# EAGLE design mutteruhr-Haus (EAGLE 6.4)
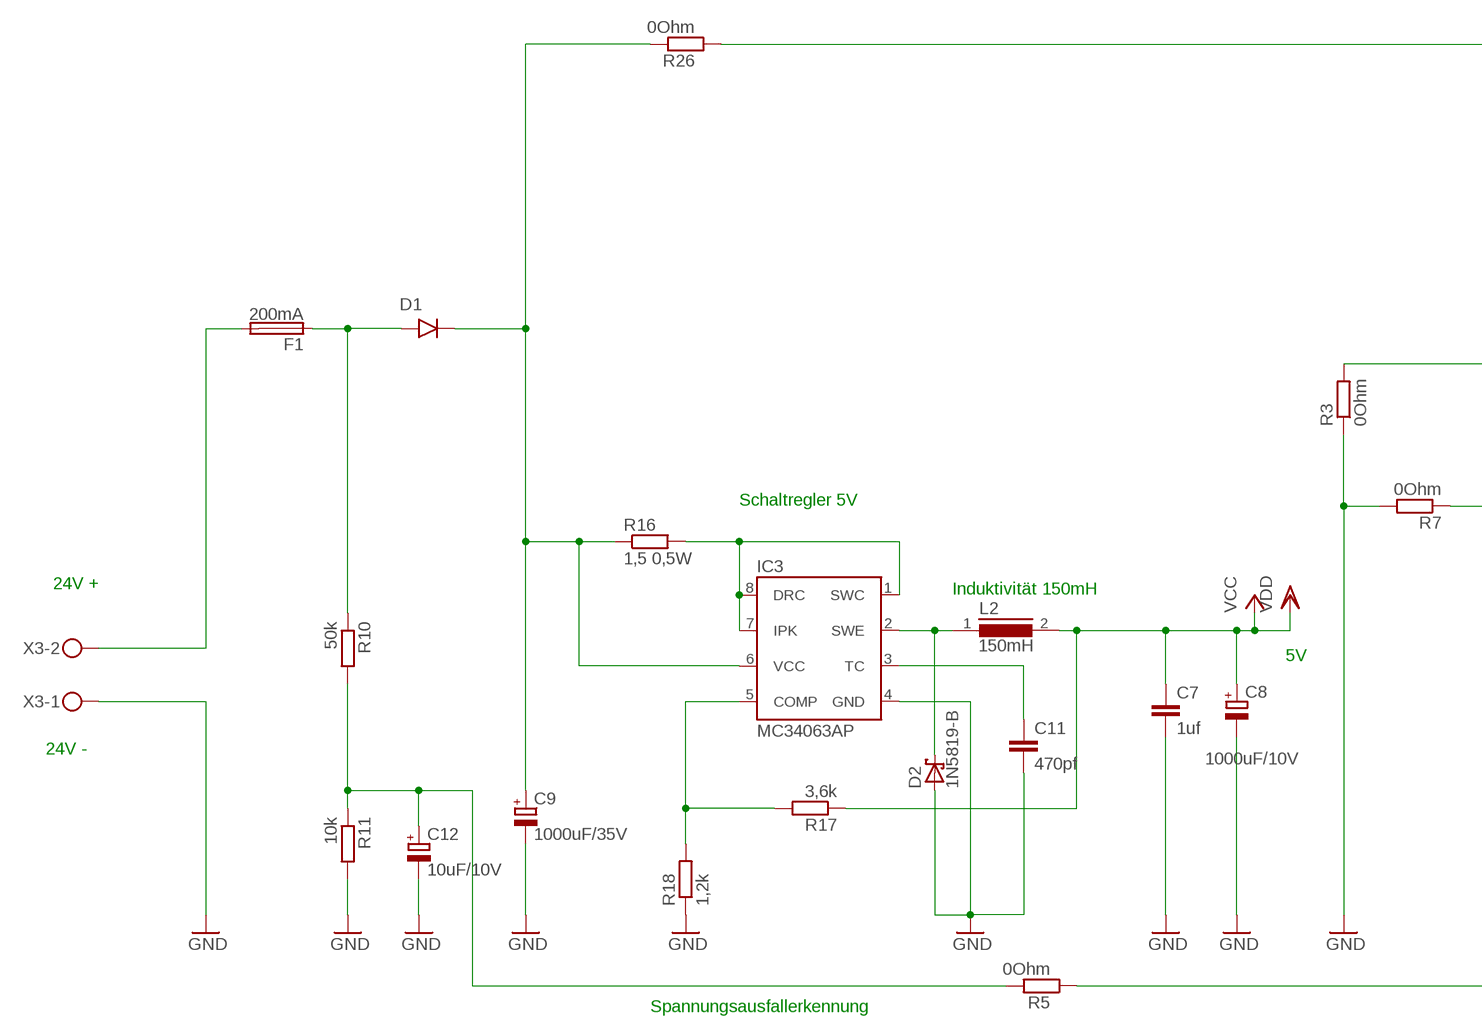
[diagram p0: schematic, sheet 1, part 1 of 2]
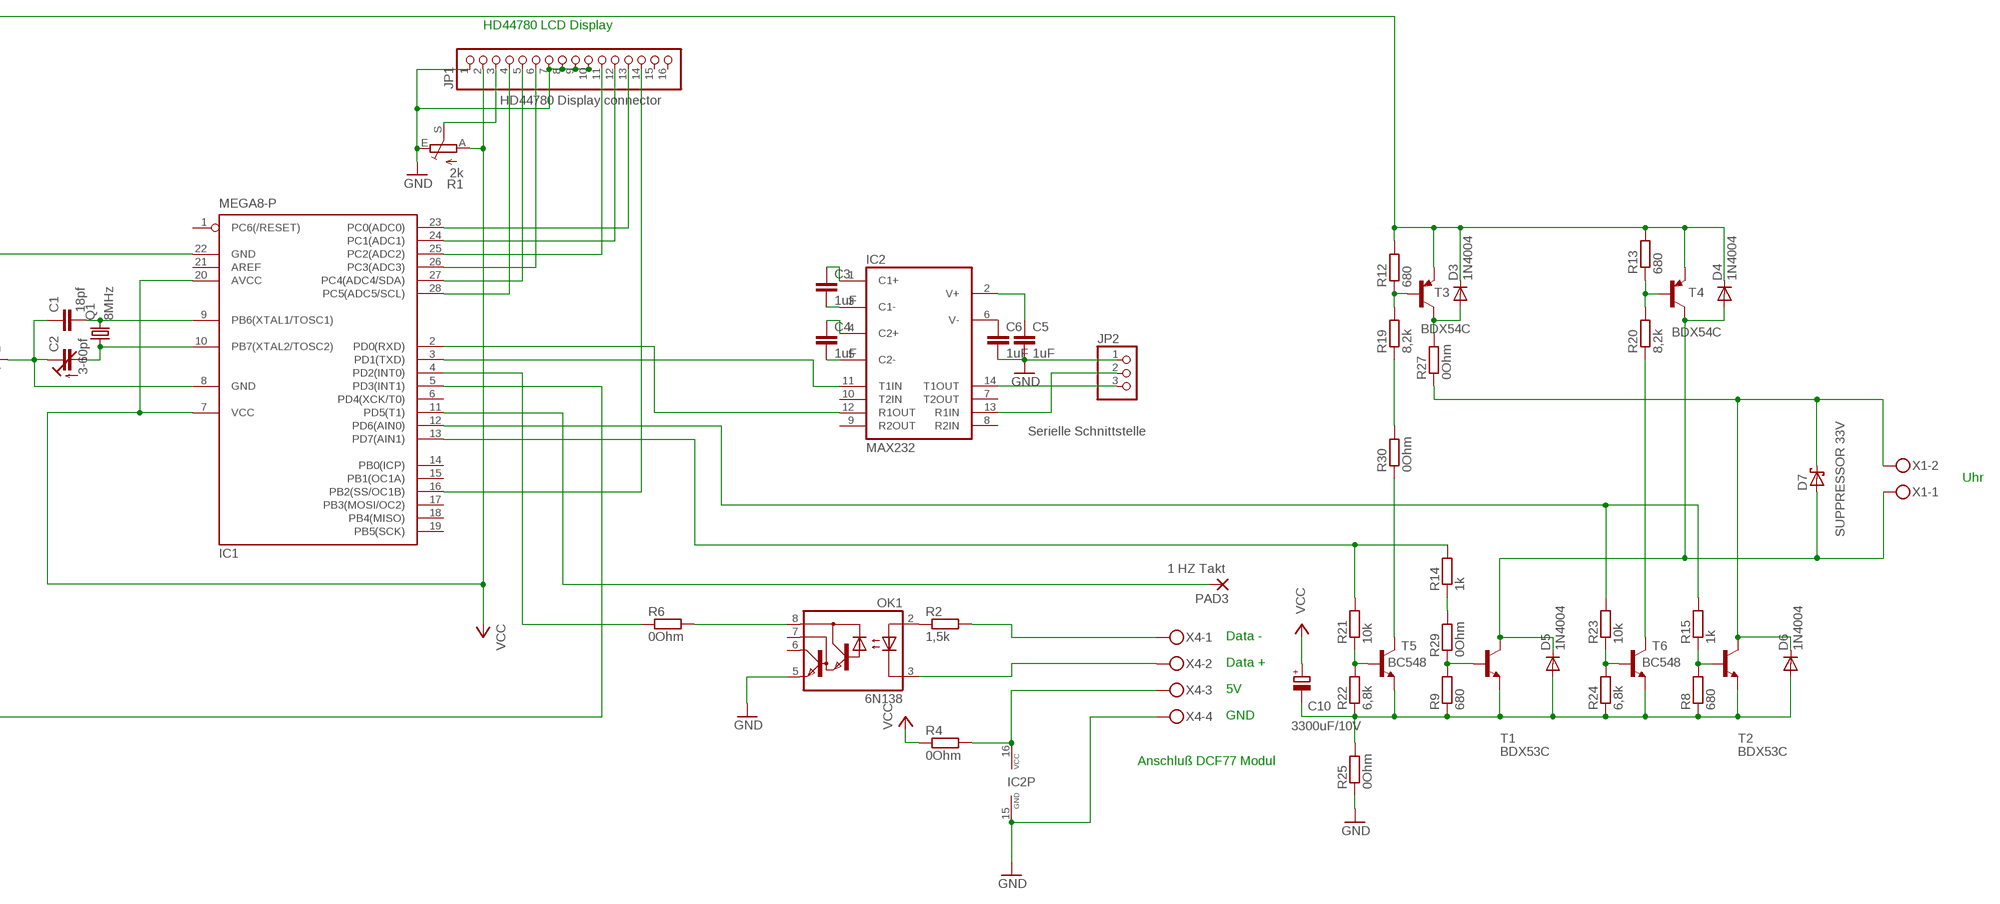
[diagram p1: schematic, sheet 1, part 2 of 2]

## Parts
C1  18pf  C-EU050-024X044  [C050-024X044]
C2  3-60pf  C-TRIMM3050.505  [CTRIM3050.505]
C3  1uF  C5/5.5  [C5B5.5]
C4  1uF  C5/5.5  [C5B5.5]
C5  1uF  C5/5.5  [C5B5.5]
C6  1uF  C5/5.5  [C5B5.5]
C7  1uf  C5/5.5  [C5B5.5]
C8  1000uF/10V  CPOL-EUE5-8.5  [E5-8,5]
C9  1000uF/35V  CPOL-EUE5-8.5  [E5-8,5]
C10  3300uF/10V  CPOL-EUE7.5-16  [E7,5-16]
C11  470pf  C5/5.5  [C5B5.5]
C12  10uF/10V  CPOL-EUE5-5  [E5-5]
D1  1N4001  [DO41-10]
D2  1N5819-B  [DO41-7.6]
D3  1N4004  [DO41-10]
D4  1N4004  [DO41-10]
D5  1N4004  [DO41-10]
D6  1N4004  [DO41-10]
D7  SUPPRESSOR 33V  P4KEXX  [DO41-10]
F1  200mA  GSH15  [GSH15]
IC1  MEGA8-P  [DIL28-3]
IC2  MAX232  [DIL16]
IC3  MC34063AP  [DIL-08]
JP1  HD44780 Display connector  PINHD-1X16_2.54  [1X16]
JP2  Serielle Schnittstelle  PINHD-1X3  [1X03]
L2  150mH  82114R  [82114R]
OK1  6N138  [DIL08]
PAD3  1 HZ Takt  2,54/0,8  [2,54/0,8]
Q1  8MHz  CRYSTALHC18U-V  [HC18U-V]
R1  2k  TRIM_EU-RS3  [RS3]
R2  1,5k  R-EU_0204/7  [0204/7]
R3  0Ohm  R-EU_0204/7  [0204/7]
R4  0Ohm  R-EU_0204/7  [0204/7]
R5  0Ohm  R-EU_0204/7  [0204/7]
R6  0Ohm  R-EU_0204/7  [0204/7]
R7  0Ohm  R-EU_0204/7  [0204/7]
R8  680  R-EU_0207/10  [0207/10]
R9  680  R-EU_0207/10  [0207/10]
R10  50k  R-EU_0204/7  [0204/7]
R11  10k  R-EU_0204/7  [0204/7]
R12  680  R-EU_0207/10  [0207/10]
R13  680  R-EU_0207/10  [0207/10]
R14  1k  R-EU_0207/10  [0207/10]
R15  1k  R-EU_0207/10  [0207/10]
R16  1,5 0,5W  R-EU_0204/7  [0204/7]
R17  3,6k  R-EU_0204/7  [0204/7]
R18  1,2k  R-EU_0204/7  [0204/7]
R19  8,2k  R-EU_0207/10  [0207/10]
R20  8,2k  R-EU_0207/10  [0207/10]
R21  10k  R-EU_0207/10  [0207/10]
R22  6,8k  R-EU_0204/2V  [0204V]
R23  10k  R-EU_0207/10  [0207/10]
R24  6,8k  R-EU_0204/2V  [0204V]
R25  0Ohm  R-EU_0204/7  [0204/7]
R26  0Ohm  R-EU_0204/7  [0204/7]
R27  0Ohm  R-EU_0207/10  [0207/10]
R29  0Ohm  R-EU_0207/10  [0207/10]
R30  0Ohm  R-EU_0207/10  [0207/10]
T1  BDX53C  -NPN-TO220V  [TO220V]
T2  BDX53C  -NPN-TO220V  [TO220V]
T3  BDX54C  -PNP-TO220V  [TO220V]
T4  BDX54C  -PNP-TO220V  [TO220V]
T5  BC548  2N5551-NPN-TO92-EBC  [TO92-EBC]
T6  BC548  2N5551-NPN-TO92-EBC  [TO92-EBC]
X1  MKDSN1,5/2-5,08  [MKDSN1,5/2-5,08]
X3  MKDSN1,5/2-5,08  [MKDSN1,5/2-5,08]
X4  MKDSN1,5/4-5,08  [MKDSN1,5/4-5,08]

## Nets
GND: C5.2 C6.2 C7.2 C8.- C9.- C11.2 C12.- D2.A IC2.15(GND) IC3.4(GND) JP1.1 JP1.7 JP1.8 JP1.9 JP1.10 JP2.1 OK1.5(GND) R1.E R3.1 R7.2 R11.2 R18.1 R25.1 X3.1 X4.4
N$1: IC1.4(PD2(INT0)) R6.1
N$2: C1.2 IC1.9(PB6(XTAL1/TOSC1)) Q1.2
N$3: C2.2(A) IC1.10(PB7(XTAL2/TOSC2)) Q1.1
N$4: IC1.23(PC0(ADC0)) JP1.13
N$5: IC1.24(PC1(ADC1)) JP1.12
N$6: IC1.25(PC2(ADC2)) JP1.11
N$7: IC1.26(PC3(ADC3)) JP1.6
N$8: IC1.27(PC4(ADC4/SDA)) JP1.5
N$9: IC1.28(PC5(ADC5/SCL)) JP1.4
N$10: IC1.16(PB2(SS/OC1B)) JP1.14
N$11: IC2.13(R1IN) JP2.2
N$12: JP1.3 R1.S
N$13: IC1.3(PD1(TXD)) IC2.11(T1IN)
N$14: IC1.2(PD0(RXD)) IC2.12(R1OUT)
N$15: C6.1 IC2.6(V-)
N$16: C5.1 IC2.2(V+)
N$17: C3.2 IC2.3(C1-)
N$18: C3.1 IC2.1(C1+)
N$19: C4.1 IC2.4(C2+)
N$20: C4.2 IC2.5(C2-)
N$21: IC2.14(T1OUT) JP2.3
N$22: IC1.13(PD7(AIN1)) R14.2 R21.2
N$23: IC1.5(PD3(INT1)) R5.1
N$24: D3.C D4.C R12.2 R13.2 R26.1 T3.3(E) T4.3(E)
N$25: IC1.11(PD5(T1)) PAD3.1(P)
N$26: D1.A(ANODE) F1.1 R10.1
N$27: OK1.3(C) X4.2
N$28: C9.+ D1.C(CATHODE) IC3.6(VCC) R16.1 R26.2
N$29: F1.2 X3.2
N$30: OK1.2(A) R2.1
N$31: IC1.22(GND) R3.2
N$32: R2.2 X4.1
N$33: C12.+ R5.2 R10.2 R11.1
N$34: OK1.8(VCC) R6.2
N$35: C1.1 C2.1(E) IC1.8(GND) R7.1
N$36: IC2.16(VCC) R4.2 X4.3
N$37: IC3.5(COMP) R17.2 R18.2
N$38: C11.1 IC3.3(TC)
N$39: D2.C IC3.2(SWE) L2.1
N$40: IC3.1(SWC) IC3.7(IPK) IC3.8(DRC) R16.2
N$41: C10.- D5.A D6.A R8.1 R9.1 R22.1 R24.1 R25.2 T1.3(E) T2.3(E) T5.E T6.E
N$42: R21.1 R22.2 T5.B
N$43: R9.2 R29.1 T1.1(B)
N$44: IC1.12(PD6(AIN0)) R15.2 R23.2
N$45: R23.1 R24.2 T6.B
N$46: R8.2 R15.1 T2.1(B)
N$48: D4.A D5.C D7.A T1.2(C) T4.2(C) X1.1
N$49: D3.A R27.2 T3.2(C)
N$50: R13.1 R20.2 T4.1(B)
N$51: R12.1 R19.2 T3.1(B)
N$52: R30.1 T5.C
N$53: D6.C D7.C R27.1 T2.2(C) X1.2
N$54: R14.1 R29.2
N$55: R20.1 T6.C
N$56: R19.1 R30.2
VCC: C7.1 C8.+ C10.+ IC1.7(VCC) IC1.20(AVCC) JP1.2 L2.2 R1.A R4.1 R17.1 ; supply symbol labelled VDD
Unconnected: IC1.1(PC6(/RESET)) IC1.6(PD4(XCK/T0)) IC1.14(PB0(ICP)) IC1.15(PB1(OC1A)) IC1.17(PB3(MOSI/OC2)) IC1.18(PB4(MISO)) IC1.19(PB5(SCK)) IC1.21(AREF) IC2.7(T2OUT) IC2.8(R2IN) IC2.9(R2OUT) IC2.10(T2IN) JP1.15 JP1.16 OK1.6(VO) OK1.7(VB)

## Notes on the sheet
- HD44780 LCD Display
- Schaltregler 5V
- 24V +
- Induktivität 150mH
- 5V
- Uhr
- 24V -
- Data -
- Data +
- 5V
- GND
- Spannungsausfallerkennung
- Anschluß DCF77 Modul

## Library data of the parts
C1 = rcl:C-EU: CAPACITOR, European symbol
C2 = rcl:C-TRIMM: Trimm capacitor
C3-C7 C11 = capacitor-wima:C: CAPACITOR naming: grid - package width
C8-C10 = rcl:CPOL-EU: POLARIZED CAPACITOR, European symbol
C12 = rcl-2:CPOL-EU: POLARIZED CAPACITOR, European symbol
D1 = tango:1N4001: DIODE general purpose rectifier, 1 A
D2 = diode:1N581*: 1.0A SCHOTTKY BARRIER RECTIFIER Source: http://www.diodes.com/datasheets/ds23001.pdf
D3-D6 = diode:1N4004: DIODE general purpose rectifier, 1 A
D7 = diode:P4KEXX: DIODE transient-voltage suppressor
F1 = fuse:GSH15: FUSE HOLDER grid 15mm, 19649 Wickmann; MPN: 64900001039; OC_FARNELL: 1271673; OC_NEWARK: 02P0318
IC1 = atmel:MEGA8-P: MICROCONTROLLER 8 Kbytes FLASH, 1 kbytes SRAM, 512 bytes EEPROM, USART, 4-channel 10 bit ADC, 2-channel 8 bit ADC Pin compatible with Atmega48, ATMega88, ATMega168 Source: avr.lbr
IC2 = maxim:MAX232: RS232 TRANSEIVER
IC3 = v-reg-3:MC34063A: 1.5A Step-Up/Down/Inverting Switching Regulator NPN Darlington Switch, Vin 3V to 40V, Current Limiter Input, adjustable Frequency up to 100kHz
JP1 = pinhead-2:PINHD-1X16: PIN HEADER
JP2 = pinhead:PINHD-1X3: PIN HEADER
L2 = inductors:82114R: INDUCTOR
OK1 = optocoupler:6N138: MOTOROLA OPTO COUPLER; MF: VISHAY/TELEFUNKEN; MPN: 6N138; OC_FARNELL: 9860150; OC_NEWARK: 35K5294
PAD3 = wirepad:2,54/0,8: THROUGH-HOLE PAD
Q1 = crystal:CRYSTAL: CRYSTAL
R1 = pot:TRIM_EU-: POTENTIOMETER
R2-R7 R10 R11 R16-R18 R25 R26 = rcl:R-EU_: RESISTOR, European symbol
R8 R9 R12-R15 R19-R24 R27 R29 R30 = resistor:R-EU_: RESISTOR, European symbol
T1 T2 = transistor:*-NPN-: NPN Transistror BF959 corrected 2008.03.06
T3 T4 = transistor:*-PNP-: PNP Transistror
T5 T6 = transistor-neu-to92:*-NPN-: NPN Transistror BF959 corrected 2008.03.06
X1 X3 = con-phoenix-508:MKDSN1,5/2-5,08: MKDSN 1,5/ 2-5,08 Printklemme Nennstrom: 13,5 A Nennspannung: 250 V Rastermaß: 5,08 mm Polzahl: 2 Anschlussart: Schraubanschluss Montage: Löten Anschlussrichtung Leiter/Platine: 0 ° Artikelnummer: 1729128 Source: http://eshop.phoenixcontact.com .. 1729128.pdf; MPN: MKDSN 1,5/2-5.08; OC_FARNELL: 1792903; OC_NEWARK: 30M2397
X4 = con-phoenix-508:MKDSN1,5/4-5,08: MKDSN 1,5/ 4-5,08 Printklemme Nennstrom: 13,5 A Nennspannung: 250 V Rastermaß: 5,08 mm Polzahl: 4 Anschlussart: Schraubanschluss Montage: Löten Anschlussrichtung Leiter/Platine: 0 ° Artikelnummer: 1729144 Source: http://eshop.phoenixcontact.com .. 1729144.pdf; MPN: SMKDSN1,5/4-5,08; OC_FARNELL: 1792905; OC_NEWARK: 70R0300

## Board
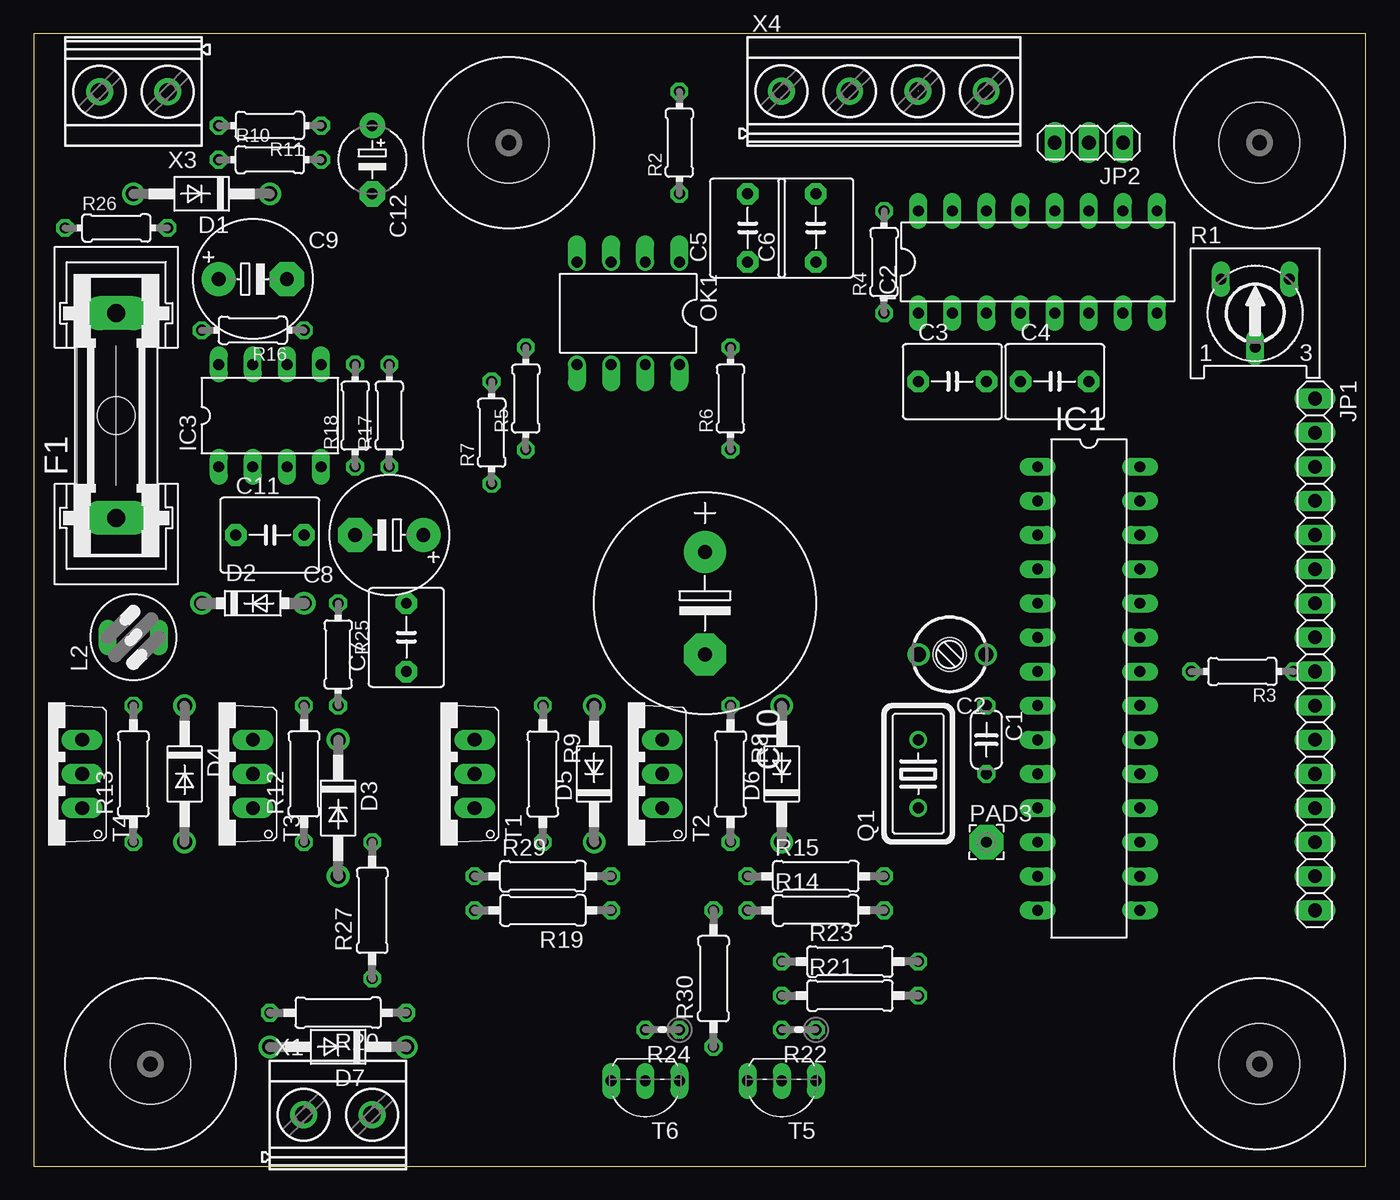
[diagram p2: board, top side]
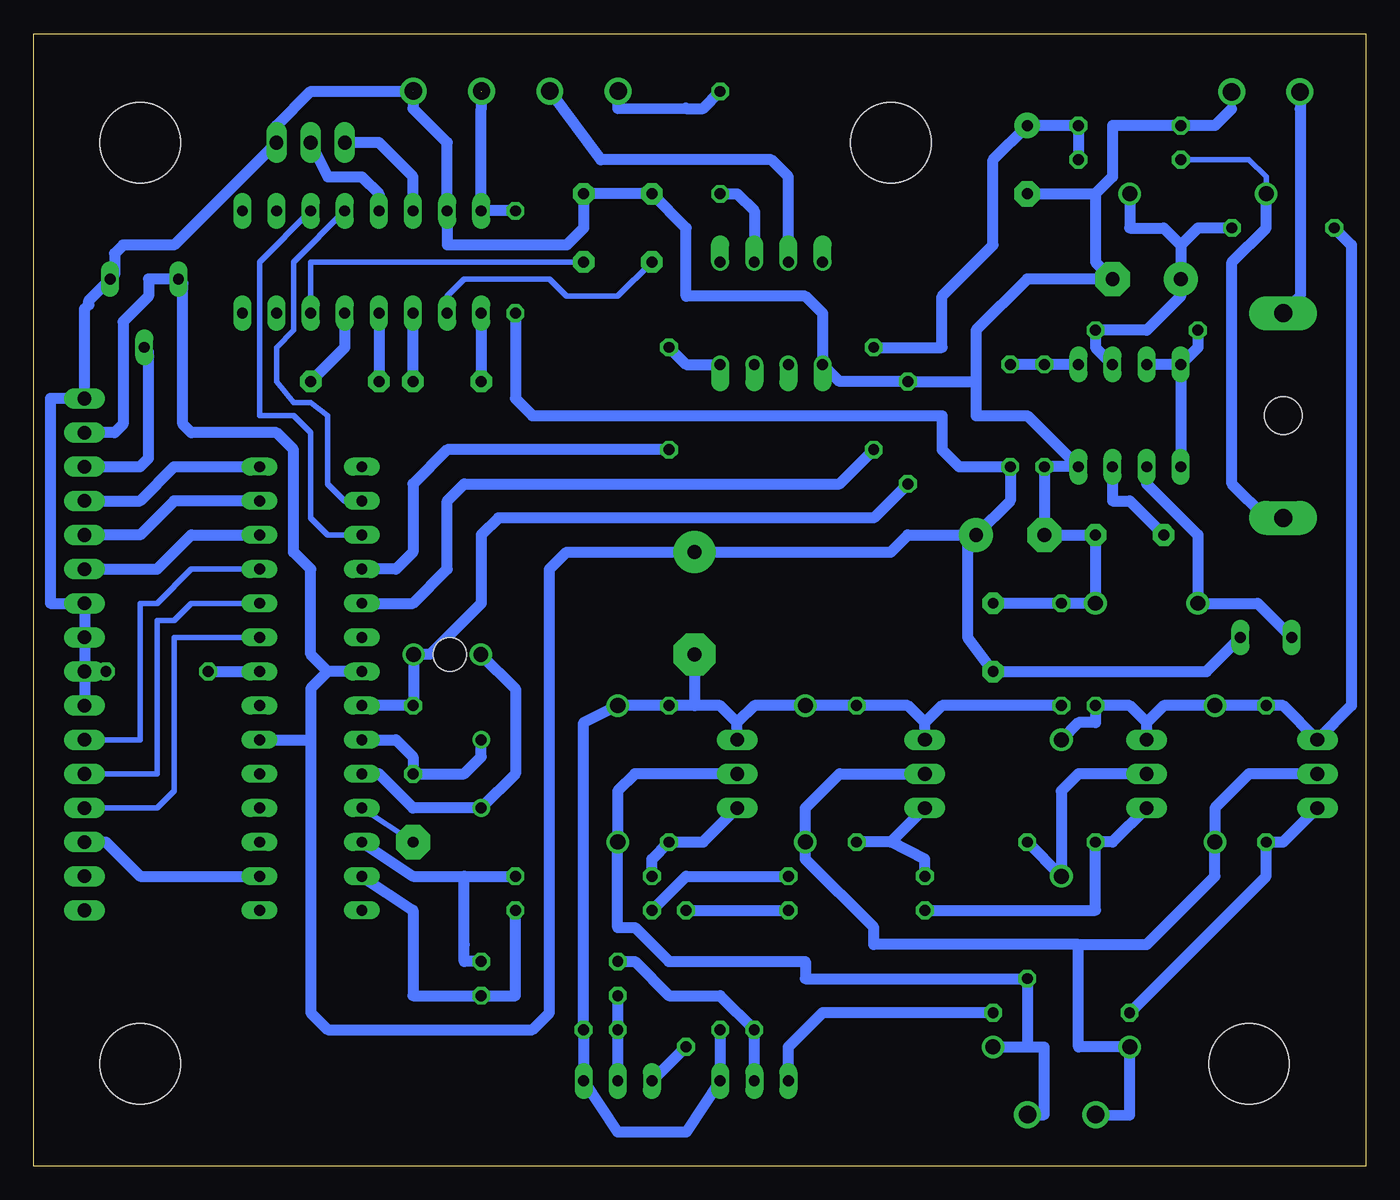
[diagram p3: board, bottom side, seen from below]

Size 99.17 x 84.32 mm. Coordinates in mm from the lower left corner, seen from the top.
Outline: 0,0 99.17,0 99.17,84.32 0,84.32 0,0
Copper layers 16: Bottom 0.035mm
Design rules "default": minimum track width 10mil, minimum drill 24mil, track to track 8mil, track to pad 8mil, pad to pad 8mil, via to via 8mil, smd to smd 8mil, copper to edge 40mil, drill to drill 8mil, minimum pad ring 10mil, minimum via ring 8mil, stop-mask expansion 4mil, vias tented up to drill 0mil, thermal gap 10mil

### Footprints (pad centres in the part's own frame; a part is rotated, then mirrored left to right if it is on the bottom)
C050-024X044 = drill 0.813 octagon: 1 -2.54,0; 2 2.54,0
CTRIM3050.505 = drill 1.1: 1 -2.5,0; 2 2.5,0 | hole 2.5: 0.2,0
C5B5.5 = drill 0.813 pad 1.6 octagon: 1 -2.54,0; 2 2.54,0
E5-8,5 = drill 1.016 pad 2.54: + -2.54,0 | drill 1.016 pad 2.54 octagon: - 2.54,0
E7,5-16 = drill 1.016 pad 3.15: + -3.81,0 | drill 1.016 pad 3.15 octagon: - 3.81,0
E5-5 = drill 0.813 pad 1.905: + -2.54,0 | drill 0.813 pad 1.905 octagon: - 2.54,0
DO41-10 = drill 1.118: A 5.08,0; C -5.08,0
DO41-7.6 = drill 1.1 pad 1.7: A 3.81,0; C -3.81,0
GSH15 = drill 1.321 pad 2.54 long: 1 -7.62,0; 2 7.62,0 | hole 2.794: 0,0
DIL28-3 = drill 0.813 long: 1 -16.51,-3.81; 2 -13.97,-3.81; 3 -11.43,-3.81; 4 -8.89,-3.81; 5 -6.35,-3.81; 6 -3.81,-3.81; 7 -1.27,-3.81; 8 1.27,-3.81; 9 3.81,-3.81; 10 6.35,-3.81; 11 8.89,-3.81; 12 11.43,-3.81; 13 13.97,-3.81; 14 16.51,-3.81; 15 16.51,3.81; 16 13.97,3.81; 17 11.43,3.81; 18 8.89,3.81; 19 6.35,3.81; 20 3.81,3.81; 21 1.27,3.81; 22 -1.27,3.81; 23 -3.81,3.81; 24 -6.35,3.81; 25 -8.89,3.81; 26 -11.43,3.81; 27 -13.97,3.81; 28 -16.51,3.81
DIL16 = drill 0.813 long: 1 -8.89,-3.81; 2 -6.35,-3.81; 3 -3.81,-3.81; 4 -1.27,-3.81; 5 1.27,-3.81; 6 3.81,-3.81; 7 6.35,-3.81; 8 8.89,-3.81; 9 8.89,3.81; 10 6.35,3.81; 11 3.81,3.81; 12 1.27,3.81; 13 -1.27,3.81; 14 -3.81,3.81; 15 -6.35,3.81; 16 -8.89,3.81
DIL-08 = drill 0.813 long: 1 -3.81,-3.81; 2 -1.27,-3.81; 3 1.27,-3.81; 4 3.81,-3.81; 5 3.81,3.81; 6 1.27,3.81; 7 -1.27,3.81; 8 -3.81,3.81
1X16 = drill 1.016 long: 1 -19.05,0; 2 -16.51,0; 3 -13.97,0; 4 -11.43,0; 5 -8.89,0; 6 -6.35,0; 7 -3.81,0; 8 -1.27,0; 9 1.27,0; 10 3.81,0; 11 6.35,0; 12 8.89,0; 13 11.43,0; 14 13.97,0; 15 16.51,0; 16 19.05,0
1X03 = drill 1.016 long: 1 -2.54,0; 2 0,0; 3 2.54,0
82114R = drill 0.813 long: 1 0,1.905; 2 0,-1.905
DIL08 = drill 0.813 offset: 1 -3.81,-3.81; 2 -1.27,-3.81; 3 1.27,-3.81; 4 3.81,-3.81; 5 3.81,3.81; 6 1.27,3.81; 7 -1.27,3.81; 8 -3.81,3.81
2,54/0,8 = drill 0.813 pad 2.54 octagon: 1 0,0
HC18U-V = drill 0.813: 1 -2.54,0; 2 2.54,0
RS3 = drill 0.813 long: A -2.54,2.54; E 2.54,2.54; S 0,-2.54
0204/7 = drill 0.813 octagon: 1 -3.81,0; 2 3.81,0
0207/10 = drill 0.813 octagon: 1 -5.08,0; 2 5.08,0
0204V = drill 0.813 octagon: 1 -1.27,0; 2 1.27,0
TO220V = drill 1.016 long: 1 -2.54,-2.54; 2 0,-2.54; 3 2.54,-2.54
TO92-EBC = drill 0.813 long: B 0,-1.27; C 2.54,-1.27; E -2.54,-1.27
DRIL-6 = hole 6: 0,0
MKDSN1,5/2-5,08 = drill 1.3 pad 2: 1 -2.561,0.025; 2 2.519,0.025
MKDSN1,5/4-5,08 = drill 1.3 pad 2: 1 -7.641,0.025; 2 -2.561,0.025; 3 2.519,0.025; 4 7.599,0.025

### Placement (x,y rotation side)
C1  70.93,31.75 270 top
C2  68.39,38.1 180 top
C3  68.39,58.42 0 top
C4  76.01,58.42 0 top
C5  53.15,69.85 90 top
C6  58.23,69.85 90 top
C7  27.75,39.37 90 top
C8  26.48,46.99 180 top
C9  16.32,66.04 0 top
C10  49.97,41.91 270 top
C11  17.59,46.99 0 top
C12  25.21,74.93 270 top
D1  12.51,72.39 180 top
D2  16.32,41.91 0 top
D3  22.67,26.67 270 top
D4  11.24,29.21 270 top
D5  41.72,29.21 90 top
D6  55.69,29.21 90 top
D7  22.67,8.89 180 top
F1  6.16,55.88 90 top
IC1  78.55,35.56 270 top
IC2  74.74,67.31 0 top
IC3  17.59,55.88 0 top
JP1  95.38,38.1 270 top
JP2  78.55,76.2 180 top
L2  7.43,39.37 90 top
OK1  44.26,63.5 180 top
PAD3  70.93,24.13 0 top
Q1  65.85,29.21 90 top
R1  90.93,63.5 0 top
R2  48.07,76.2 90 top
R3  89.98,36.83 180 top
R4  63.31,67.31 90 top
R5  36.64,57.15 90 top
R6  51.88,57.15 90 top
R7  34.1,54.61 90 top
R8  51.88,29.21 270 top
R9  37.91,29.21 270 top
R10  17.59,74.93 0 top
R11  17.59,77.47 180 top
R12  20.13,29.21 90 top
R13  7.43,29.21 90 top
R14  58.23,19.05 0 top
R15  58.23,21.59 0 top
R16  16.32,62.23 180 top
R17  26.48,55.88 90 top
R18  23.94,55.88 90 top
R19  37.91,19.05 180 top
R20  22.67,11.43 180 top
R21  60.77,12.7 0 top
R22  56.96,10.16 180 top
R23  60.77,15.24 0 top
R24  46.8,10.16 180 top
R25  22.67,38.1 270 top
R26  6.16,69.85 0 top
R27  25.21,19.05 90 top
R29  37.91,21.59 0 top
R30  50.61,13.97 90 top
T1  30.29,29.21 90 top
T2  44.26,29.21 90 top
T3  13.78,29.21 90 top
T4  1.08,29.21 90 top
T5  55.69,5.08 180 top
T6  45.53,5.08 180 top
U$1  [DRIL-6]  35.37,76.2 0 top
U$2  [DRIL-6]  8.7,7.62 0 top
U$3  [DRIL-6]  91.25,7.62 0 top
U$4  [DRIL-6]  91.25,76.2 0 top
X1  22.67,3.81 0 top
X3  7.43,80.01 180 top
X4  63.31,80.01 0 top

### Tracks (layer width: path | path; a pad name or v marks a point on that pad's centre or on a via)
GND  (1 unrouted)
  Bottom 0.406: X3.1 9.99,78.72
  Bottom 0.813: 9.99,78.72 11.24,77.47 R11.2 18.86,77.47 18.86,73.66 20.13,72.39 | 20.13,72.39 20.13,67.31 C9.- 25.21,66.04 29.02,62.23 29.02,58.42 | C7.2 R25.1 D2.A C11.2 C8.- R18.1 IC3.4 25.21,55.88 29.02,55.88 29.02,58.42 | C12.- 20.13,72.39 | JP1.9 JP1.8 JP1.7 97.92,41.91 97.92,57.15 JP1.1 95.38,63.82 95.06,64.14 95.06,64.45 R1.E 93.15,66.36 93.15,67.95 92.52,68.58 88.71,68.58 JP2.1 81.09,77.47 78.55,80.01 70.93,80.01 70.93,78.74 68.39,76.2 IC2.15 68.39,68.58 59.5,68.58 58.23,69.85 C6.2 C5.2 50.61,69.85 50.61,64.77 41.72,64.77 40.45,63.5 OK1.5 39.18,58.42 R7.2 29.02,58.42 | JP1.9 JP1.10 | R3.1 JP1.9
N$1
  Bottom 0.813: R6.1 68.39,53.34 70.93,50.8 70.93,45.72 72.2,44.45 IC1.4
N$2
  Bottom 0.813: IC1.9 72.2,31.75 70.93,30.48 C1.2 67.12,29.21 65.85,30.48 Q1.2
N$3
  Bottom 0.813: C2.2 63.35,35.56 63.31,35.56 63.31,29.21 Q1.1 70.93,26.67 73.47,29.21 IC1.10
N$4
  Bottom 0.406: IC1.23 88.71,39.37 88.71,27.94 89.98,26.67 JP1.13
N$5
  Bottom 0.406: JP1.12 89.98,29.21 89.98,40.64 88.71,40.64 87.44,41.91 IC1.24
N$6
  Bottom 0.406: IC1.25 87.44,44.45 89.98,41.91 91.25,41.91 91.25,31.75 JP1.11
N$7
  Bottom 0.813: JP1.6 89.98,44.45 87.44,46.99 IC1.26
N$8
  Bottom 0.813: IC1.27 88.71,49.53 91.25,46.99 JP1.5
N$9
  Bottom 0.813: JP1.4 91.25,49.53 88.71,52.07 IC1.28
N$10
  Bottom 0.813: JP1.14 93.79,24.13 91.25,21.59 IC1.16
N$11
  Bottom 0.813: JP2.2 77.28,73.66 74.74,73.66 73.47,72.39 IC2.13
N$12
  Bottom 0.813: JP1.3 91.25,52.07 90.61,52.71 90.61,60.64 R1.S
N$13
  Bottom 0.406: IC2.11 82.36,67.31 82.36,55.88 79.82,55.88 78.55,54.61 78.55,48.26 77.28,46.99 IC1.3
N$14
  Bottom 0.406: IC1.2 76.01,49.53 77.28,50.8 77.28,55.88 78.55,56.83 79.82,56.83 81.09,58.42 81.09,60.96 79.82,62.23 79.82,67.31 IC2.12
N$15
  Bottom 0.406: IC2.6 78.55,67.31 C6.1
N$16
  Bottom 0.406: C5.1 55.69,64.77 59.5,64.77 60.77,66.04 67.12,66.04 68.39,64.77 IC2.2
N$17
  Bottom 0.813: C3.2 IC2.3
N$18
  Bottom 0.813: IC2.1 C3.1
N$19
  Bottom 0.813: IC2.4 C4.1
N$20
  Bottom 0.813: IC2.5 76.01,60.96 C4.2
N$21
  Bottom 0.813: IC2.14 70.93,73.66 73.47,76.2 JP2.3
N$22
  Bottom 0.813: IC1.13 70.93,19.05 70.93,12.7 R21.2 63.31,12.7 R14.2
N$23
  Bottom 0.813: IC1.5 70.93,41.91 68.39,44.45 68.39,49.53 67.12,50.8 39.18,50.8 R5.1
N$24
  Bottom 0.813: R26.1 1.08,68.58 1.08,34.29 T4.3 6.16,34.29 R13.2 D4.C 15.05,34.29 16.32,33.02 | T3.3 16.32,33.02 | 16.32,33.02 17.59,34.29 R12.2 20.13,33.02 21.4,33.02 D3.C
N$25
  Bottom 0.406: IC1.11 PAD3.1
N$26
  Bottom 0.406: D1.A 7.43,73.66 8.7,74.93 R10.1
  Bottom 0.813: F1.1 7.43,48.26 9.97,50.8 9.97,67.31 7.43,69.85 D1.A
N$27
  Bottom 0.813: OK1.3 42.99,73.66 44.26,74.93 56.96,74.93 56.96,74.98 X4.2
N$28
  Bottom 0.813: D1.C 17.59,69.85 15.05,69.85 13.78,68.58 | 13.78,68.58 C9.+ 13.78,64.77 16.32,62.23 R16.1 20.13,60.96 IC3.6 | R26.2 12.51,69.85 13.78,68.58
N$29
  Bottom 0.813: X3.2 4.89,78.72 4.89,64.77 F1.2
N$30
  Bottom 0.813: R2.1 46.8,72.39 45.53,71.12 OK1.2
N$31
  Bottom 0.813: R3.2 IC1.22
N$32
  Bottom 0.813: X4.1 55.69,80.03 55.69,78.74 50.63,78.77 50.61,78.74 49.34,78.74 R2.2
N$33
  Bottom 0.813: R10.2 R11.1 C12.+ 27.75,74.93 27.75,68.58 31.56,64.77 31.56,60.96 R5.2
N$34
  Bottom 0.813: R6.2 50.61,59.69 OK1.8
N$35
  Bottom 0.813: R7.1 36.64,48.26 64.58,48.26 65.85,46.99 65.85,41.91 69.66,38.1 C2.1 70.89,34.33 C1.1 IC1.8
N$36  (1 unrouted)
  Bottom 0.813: R4.2 IC2.16 65.85,78.74 65.85,80.01
N$37
  Bottom 0.813: IC3.5 R18.2 R17.2
N$38
  Bottom 0.813: IC3.3 18.86,49.53 17.59,49.53 C11.1
N$39
  Bottom 0.813: IC3.2 16.32,50.8 12.51,46.99 D2.C 8.06,41.91 L2.1
N$40
  Bottom 0.813: R16.2 12.51,60.96 IC3.8 | IC3.8 IC3.7 | IC3.8 IC3.1
N$41
  Bottom 0.813: R25.2 31.56,34.29 32.83,33.02 | T1.3 32.83,33.02 | 32.83,33.02 34.1,34.29 R9.1 D5.A 45.53,34.29 46.8,33.02 | T2.3 46.8,33.02 | 46.8,33.02 48.07,34.29 49.97,34.29 | 49.97,34.29 R8.1 D6.A 58.23,33.02 R22.1 T5.E 55.69,2.54 50.61,2.54 T6.E R24.1 | C10.- 49.97,34.29
N$42
  Bottom 0.813: R21.1 R22.2 T5.B
N$43
  Bottom 0.813: T1.1 35.37,24.13 | 35.37,24.13 R9.2 | R29.1 32.83,22.86 35.37,24.13
N$44
  Bottom 0.813: IC1.12 70.93,21.59 67.12,21.59 | 67.12,21.59 R15.2 | R23.2 67.12,15.24 67.12,16.51 67.12,21.59
N$45
  Bottom 0.813: T6.B R24.2 48.07,12.7 51.88,12.7 54.42,15.24 R23.1
N$46
  Bottom 0.813: T2.1 49.34,24.13 R8.2 53.15,22.86 R15.1
N$48
  Bottom 0.813: T1.2 39.18,29.21 41.72,26.67 D5.C 41.72,22.86 36.64,17.78 36.64,16.51 21.4,16.51 | T4.2 8.7,29.21 11.24,26.67 D4.A 11.24,21.59 16.32,16.51 21.4,16.51 | X1.1 17.59,3.81 D7.A 21.4,8.89 21.4,16.51
N$49
  Bottom 0.813: T3.2 21.4,29.21 22.67,27.94 D3.A R27.2
N$50
  Bottom 0.813: T4.1 6.16,24.13 R13.1 7.43,21.59 R20.2
N$51
  Bottom 0.813: T3.1 18.86,24.13 R12.1 20.13,19.05 R19.2
N$52
  Bottom 0.813: R30.1 T5.C
N$53
  Bottom 0.813: T2.2 54.42,29.21 55.69,27.94 D6.C 55.69,17.78 54.42,17.78 51.88,15.24 41.72,15.24 41.72,13.97 R27.1 25.21,8.89 | X1.2 23.94,3.83 23.94,8.89 25.21,8.89 | D7.C 25.21,8.89
N$54
  Bottom 0.813: R14.1 50.61,21.59 R29.2
N$55
  Bottom 0.813: R20.1 40.45,11.43 42.99,8.89 T6.C
N$56
  Bottom 0.813: R30.2 R19.1
VCC
  Bottom 0.813: C8.+ 26.48,49.53 R17.1 30.29,52.07 31.56,53.34 31.56,55.88 62.04,55.88 63.31,57.15 R4.1 | C8.+ 29.65,46.99 29.65,39.37 C7.1 11.87,36.83 L2.2 | IC1.7 77.28,36.83 | 77.28,36.83 78.55,35.56 78.55,31.75 | 78.55,31.75 78.55,11.43 77.28,10.16 62.04,10.16 60.77,11.43 60.77,44.45 59.5,45.72 C10.+ 35.37,45.72 34.1,46.99 C8.+ | IC1.20 78.55,31.75 | 77.28,36.83 78.55,38.1 78.55,44.45 79.82,45.72 79.82,53.34 81.09,54.61 87.44,54.61 88.07,55.25 88.07,65.72 R1.A 90.61,66.04 90.61,64.77 92.52,62.87 92.52,55.25 93.15,54.61 JP1.2